# Altium schematic sheet NVME.SchDoc
size C; SheetNumber: 4; SheetTotal: 14
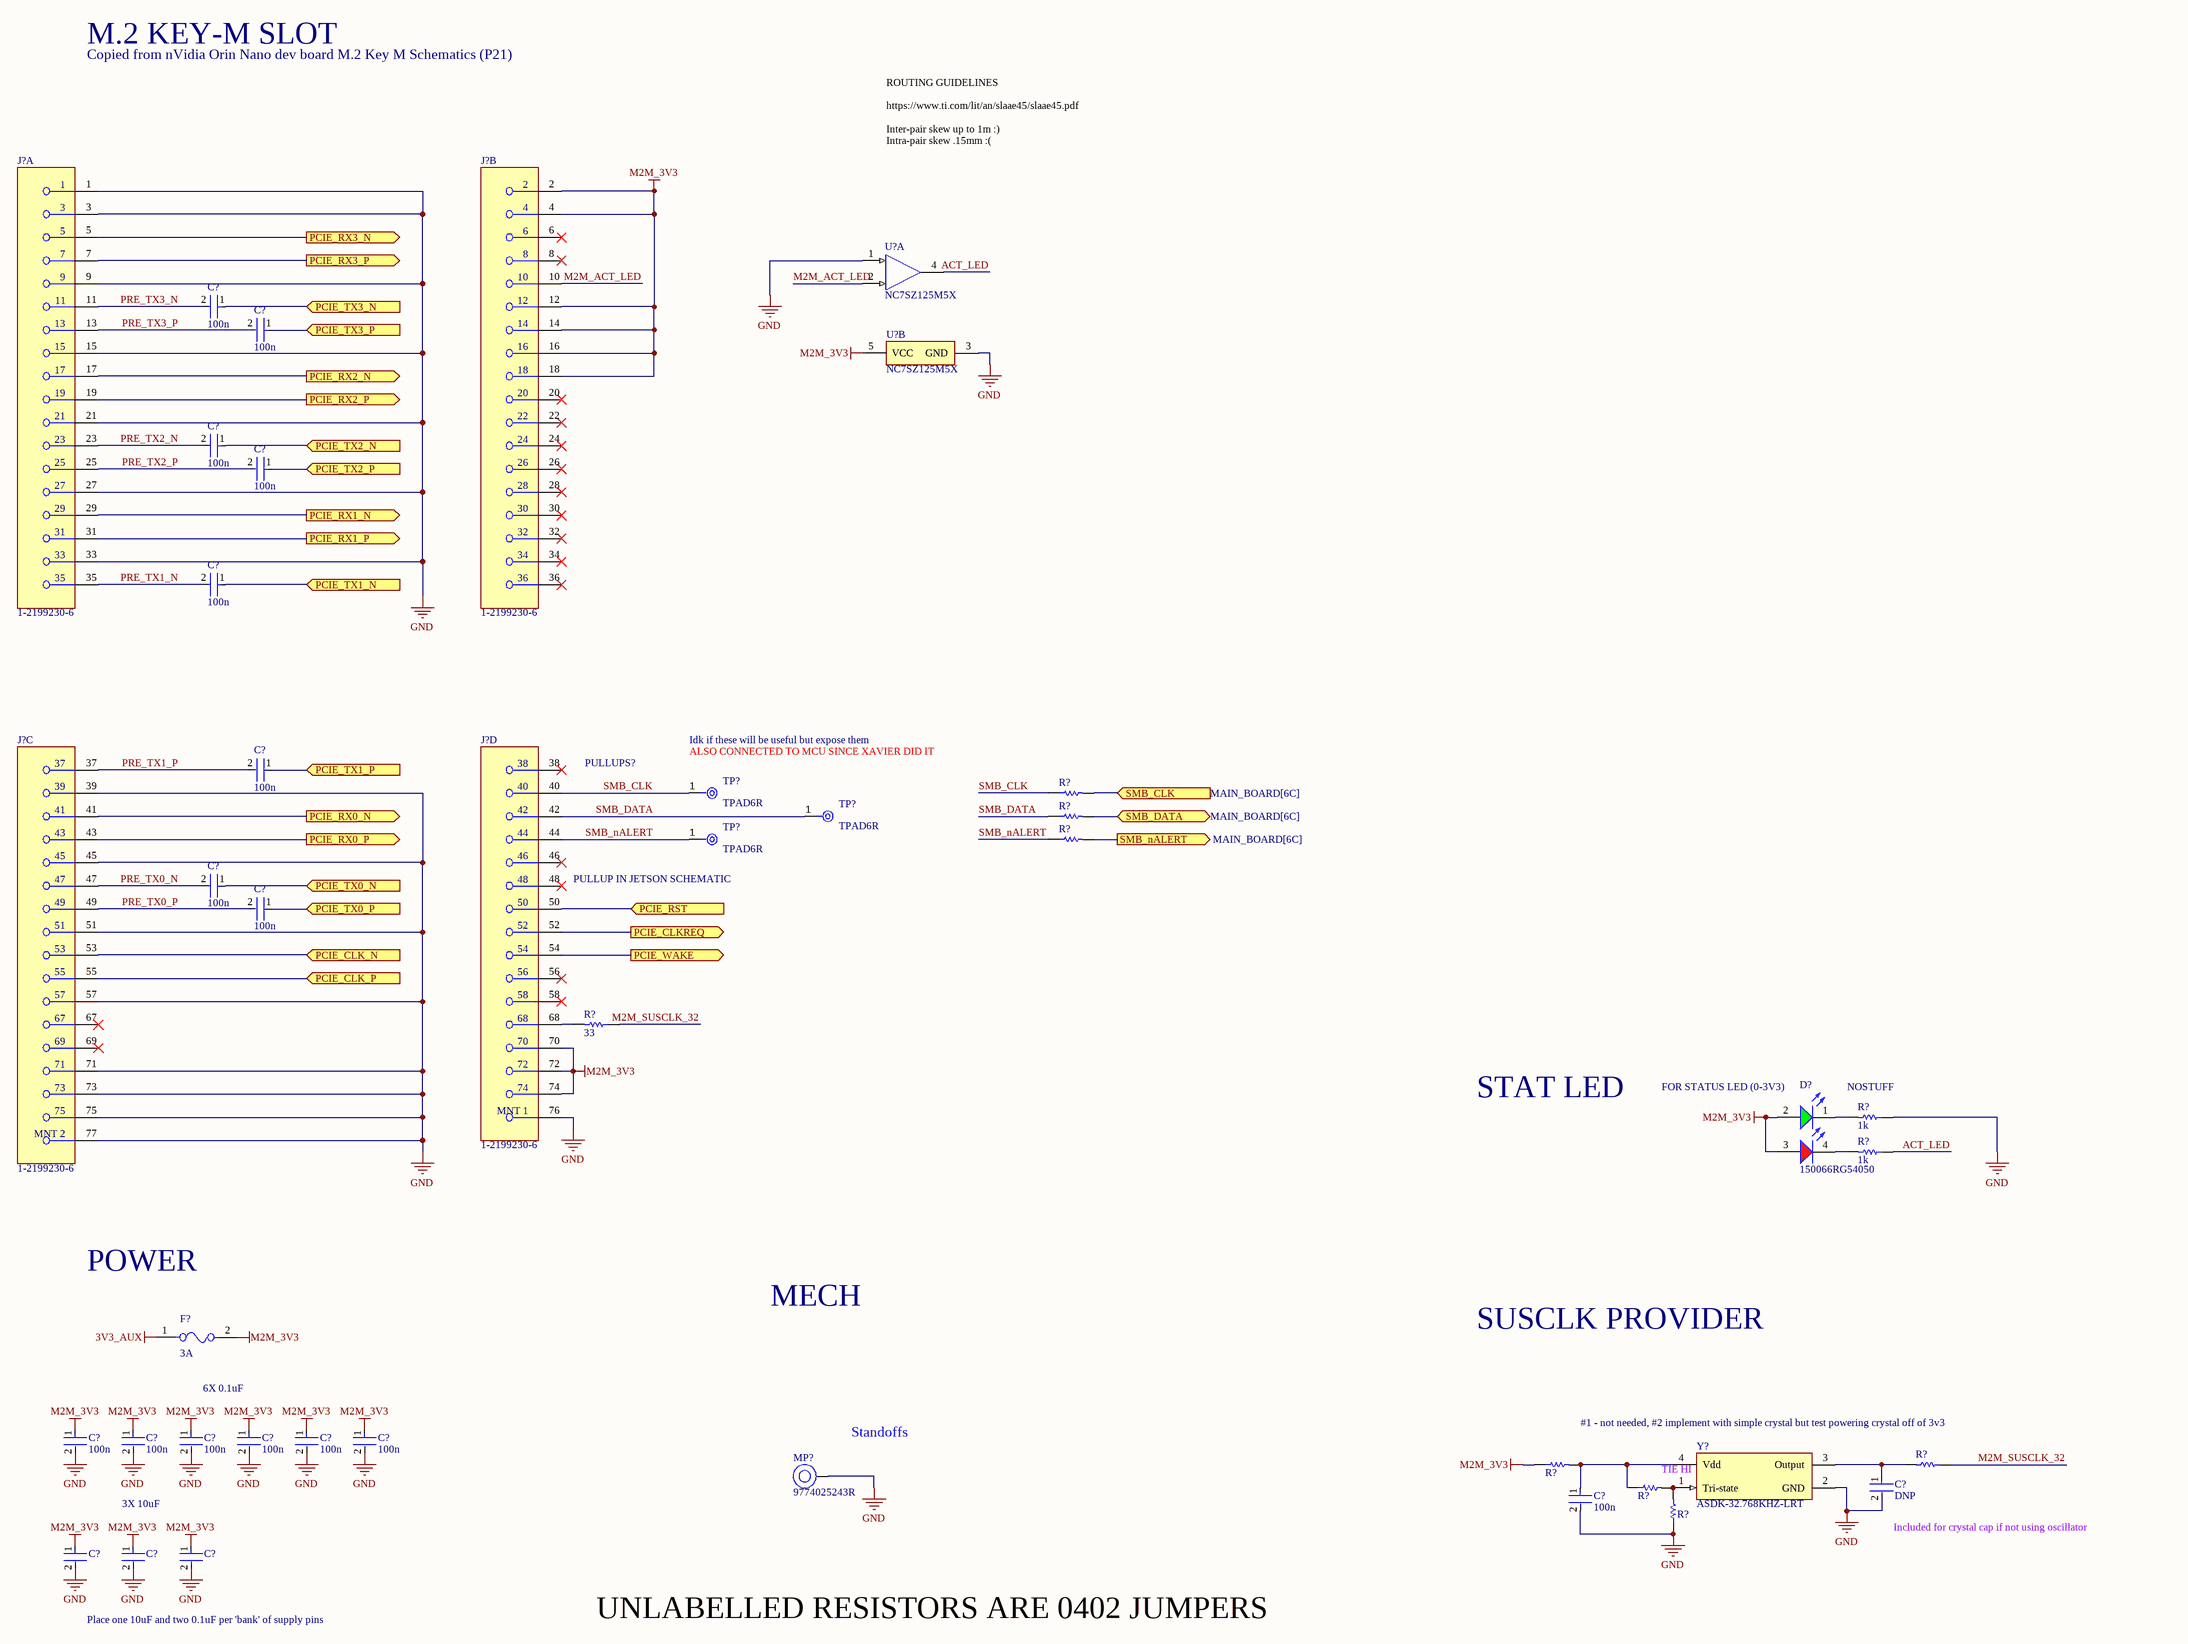
[diagram p0: NVME.SchDoc]

## Parts
(Parts that share a designator on the sheet are numbered #1, #2 ... from top to bottom, then left to right.)
C?#1  100n  [FP-0402-L_1_0_0_05-W_0_5-IPC_A]
C?#2  100n  [FP-0402-L_1_0_0_05-W_0_5-IPC_A]
C?#3  100n  [FP-0402-L_1_0_0_05-W_0_5-IPC_A]
C?#4  100n  [FP-0402-L_1_0_0_05-W_0_5-IPC_A]
C?#5  100n  [FP-0402-L_1_0_0_05-W_0_5-IPC_A]
C?#6  100n  [FP-0402-L_1_0_0_05-W_0_5-IPC_A]
C?#7  100n  [FP-0402-L_1_0_0_05-W_0_5-IPC_A]
C?#8  100n  [FP-0402-L_1_0_0_05-W_0_5-IPC_A]
C?#9  100n  [FP-0402-L_1_0_0_05-W_0_5-IPC_A]
C?#10  100n  [FP-0402-L_1_0_0_05-W_0_5-IPC_A]
C?#11  100n  [FP-0402-L_1_0_0_05-W_0_5-IPC_A]
C?#12  100n  [FP-0402-L_1_0_0_05-W_0_5-IPC_A]
C?#13  100n  [FP-0402-L_1_0_0_05-W_0_5-IPC_A]
C?#14  100n  [FP-0402-L_1_0_0_05-W_0_5-IPC_A]
C?#15  DNP  [FP-0402-L_1_0_0_05-W_0_5-IPC_A]
C?#16  100n  [FP-0402-L_1_0_0_05-W_0_5-IPC_A]
C?#17  GRM188R60J106ME47D  [FP-GRM188-0_1-e0_2_0_55-IPC_A]  (value not drawn)
C?#18  GRM188R60J106ME47D  [FP-GRM188-0_1-e0_2_0_55-IPC_A]  (value not drawn)
C?#19  GRM188R60J106ME47D  [FP-GRM188-0_1-e0_2_0_55-IPC_A]  (value not drawn)
D?  150066RG54050  [WL-SBCD_0606]
F?  3A  [FP-SF-1206FP-MFG]
J?#1  1-2199230-6  [FP-1-2199230-6-MFG]  (part A of 4)
J?#2  1-2199230-6  [FP-1-2199230-6-MFG]  (part B of 4)
J?#3  1-2199230-6  [FP-1-2199230-6-MFG]  (part C of 4)
J?#4  1-2199230-6  [FP-1-2199230-6-MFG]  (part D of 4)
MP?  9774025243R  [9774025243]
R?#1  0402 JUMPER  [RESC1005X40X25ML05T05]  (value not drawn)
R?#2  0402 JUMPER  [RESC1005X40X25ML05T05]  (value not drawn)
R?#3  0402 JUMPER  [RESC1005X40X25ML05T05]  (value not drawn)
R?#4  33  [R0603B]
R?#5  1k  [R0603B]
R?#6  1k  [R0603B]
R?#7  0402 JUMPER  [RESC1005X40X25ML05T05]  (value not drawn)
R?#8  0402 JUMPER  [RESC1005X40X25ML05T05]  (value not drawn)
R?#9  0402 JUMPER  [RESC1005X40X25ML05T05]  (value not drawn)
R?#10  DNP  [RESC1005X40X25ML05T05]  (value not drawn)
TP?#1  TPAD6R  [New footprint 1]
TP?#2  TPAD6R  [New footprint 1]
TP?#3  TPAD6R  [New footprint 1]
U?#1  NC7SZ125M5X  [FAIR-SOT23-5_V]  (part A of 2)
U?#2  NC7SZ125M5X  [FAIR-SOT23-5_V]  (part B of 2)
Y?  ASDK-32.768KHZ-LRT  [FP-ASDK-MFG]

## Ports
PCIE_CLK_N (in), PCIE_CLK_P (in), PCIE_CLKREQ (out), PCIE_RST (in), PCIE_RX0_N (out), PCIE_RX0_P (out), PCIE_RX1_N (out), PCIE_RX1_P (out), PCIE_RX2_N (out), PCIE_RX2_P (out), PCIE_RX3_N (out), PCIE_RX3_P (out), PCIE_TX0_N (in), PCIE_TX0_P (in), PCIE_TX1_N (in), PCIE_TX1_P (in), PCIE_TX2_N (in), PCIE_TX2_P (in), PCIE_TX3_N (in), PCIE_TX3_P (in), PCIE_WAKE (out), SMB_CLK (in, see MAIN_BOARD[6C]), SMB_DATA (bidir, see MAIN_BOARD[6C]), SMB_nALERT (out, see MAIN_BOARD[6C])

## Nets
3V3_AUX: F?.1
GND: C?#9.2 C?#10.2 C?#11.2 C?#12.2 C?#13.2 C?#14.2 C?#15.2 C?#16.2 C?#17.2 C?#18.2 C?#19.2 J?#1.1 J?#1.3 J?#1.9 J?#1.15 J?#1.21 J?#1.27 J?#1.33 J?#3.39 J?#3.45 J?#3.51 J?#3.57 J?#3.71 J?#3.73 J?#3.75 J?#3.77(MNT_2) J?#4.76(MNT_1) MP?.1 R?#5.1 R?#10.1 U?#1.1(~{OE}) U?#2.3(GND) Y?.2(GND)
M2M_3V3: C?#9.1 C?#10.1 C?#11.1 C?#12.1 C?#13.1 C?#14.1 C?#17.1 C?#18.1 C?#19.1 D?.2(A) D?.3(A) F?.2 J?#2.2 J?#2.4 J?#2.12 J?#2.14 J?#2.16 J?#2.18 J?#4.70 J?#4.72 J?#4.74 R?#7.1 U?#2.5(VCC)
ACT_LED: R?#6.1 U?#1.4(Y)
M2M_ACT_LED: J?#2.10 U?#1.2(A)
M2M_SUSCLK_32: R?#4.1 R?#9.1
PCIE_CLK_N: J?#3.53 ; port PCIE_CLK_N
PCIE_CLK_P: J?#3.55 ; port PCIE_CLK_P
PCIE_CLKREQ: J?#4.52 ; port PCIE_CLKREQ
PCIE_RST: J?#4.50 ; port PCIE_RST
PCIE_RX0_N: J?#3.41 ; port PCIE_RX0_N
PCIE_RX0_P: J?#3.43 ; port PCIE_RX0_P
PCIE_RX1_N: J?#1.29 ; port PCIE_RX1_N
PCIE_RX1_P: J?#1.31 ; port PCIE_RX1_P
PCIE_RX2_N: J?#1.17 ; port PCIE_RX2_N
PCIE_RX2_P: J?#1.19 ; port PCIE_RX2_P
PCIE_RX3_N: J?#1.5 ; port PCIE_RX3_N
PCIE_RX3_P: J?#1.7 ; port PCIE_RX3_P
PCIE_TX0_N: C?#7.1 ; port PCIE_TX0_N
PCIE_TX0_P: C?#8.1 ; port PCIE_TX0_P
PCIE_TX1_N: C?#5.1 ; port PCIE_TX1_N
PCIE_TX1_P: C?#6.1 ; port PCIE_TX1_P
PCIE_TX2_N: C?#3.1 ; port PCIE_TX2_N
PCIE_TX2_P: C?#4.1 ; port PCIE_TX2_P
PCIE_TX3_N: C?#1.1 ; port PCIE_TX3_N
PCIE_TX3_P: C?#2.1 ; port PCIE_TX3_P
PCIE_WAKE: J?#4.54 ; port PCIE_WAKE
PRE_TX0_N: C?#7.2 J?#3.47
PRE_TX0_P: C?#8.2 J?#3.49
PRE_TX1_N: C?#5.2 J?#1.35
PRE_TX1_P: C?#6.2 J?#3.37
PRE_TX2_N: C?#3.2 J?#1.23
PRE_TX2_P: C?#4.2 J?#1.25
PRE_TX3_N: C?#1.2 J?#1.11
PRE_TX3_P: C?#2.2 J?#1.13
SMB_CLK: J?#4.40 R?#1.1 TP?#1.1(TP)
SMB_CLK: R?#1.2 ; port SMB_CLK  [a separate net that carries the same name]
SMB_DATA: J?#4.42 R?#2.1 TP?#2.1(TP)
SMB_DATA: R?#2.2 ; port SMB_DATA  [a separate net that carries the same name]
SMB_nALERT: J?#4.44 R?#3.1 TP?#3.1(TP)
SMB_nALERT: R?#3.2 ; port SMB_nALERT  [a separate net that carries the same name]
NetC?#15_1: C?#15.1 R?#9.2 Y?.3(Output)
NetC?#16_1: C?#16.1 R?#7.2 R?#8.1 Y?.4(Vdd)
NetD?_1: D?.1(K) R?#5.2
NetD?_4: D?.4(K) R?#6.2
NetJ?#4_68: J?#4.68 R?#4.2
NetR?#8_2: R?#8.2 R?#10.2 Y?.1(Tri-state)

Not connected (* = marked no-connect by the designer): J?#2 6* 8* 20* 22* 24* 26* 28* 30* 32* 34* 36*; J?#3 67* 69*; J?#4 38* 46* 48* 56* 58*

## Notes on the sheet
- Copied from nVidia Orin Nano dev board M.2 Key M Schematics (P21)
- M.2 KEY-M SLOT
- ROUTING GUIDELINES
  https://www.ti.com/lit/an/slaae45/slaae45.pdf
  Inter-pair skew up to 1m :)
  Intra-pair skew .15mm :(
- PULLUPS?
- Idk if these will be useful but expose them
- (near TP?#1) ALSO CONNECTED TO MCU SINCE XAVIER DID IT
- PULLUP IN JETSON SCHEMATIC
- STAT LED
- (near D?) FOR STATUS LED (0-3V3)
- (near R?#5) NOSTUFF
- POWER
- MECH
- SUSCLK PROVIDER
- (near C?#12) 6X 0.1uF
- #1 - not needed, #2 implement with simple crystal but test powering crystal off of 3v3
- Standoffs
- (near Y?) TIE HI
- (near C?#18) 3X 10uF
- (near C?#15) Included for crystal cap if not using oscillator
- Place one 10uF and two 0.1uF per 'bank' of supply pins
- UNLABELLED RESISTORS ARE 0402 JUMPERS

## Library data of the parts
C?#1-C?#16 = CMP-001-00058-1: LARGE PADS, 0402 CAP, CHANGE COMMENT TO MATCH REAL P/N; Capacitor Type: Ceramic; Min Operating Temperature: -55°C; Mounting Technology: Surface Mount; Pins: 2; Case/Package: 0402; RoHS Compliant: Yes; Max Operating Temperature: 85°C
C?#17-C?#19 = CMP-2006-02792-2: Chip Multilayer Ceramic Capacitors for General Purpose, 0603, 10uF, X5R, 15%, 20%, 6.3V; Packaging: Tape and Reel; Voltage Rating (DC): 6.3V; Width: 0.031inch; Termination: SMD/SMT; Dielectric: X5R; Package Quantity: 4000; Voltage Rating: 6.3V; Capacitance: 10uF; Case/Package: 0603; Min Operating Temperature: -55°C; Voltage: 6.3V; Length: 1.6mm; Thickness: 0.035inch; Lead Free: Lead Free; Depth: 0.8mm; Case Code (Imperial): 0603; Max Operating Temperature: 85°C; Material: Ceramic; Height: 0.8mm; Tolerance: 20%; Mount: Surface Mount; REACH SVHC: No SVHC; Radiation Hardening: No; Case Code (Metric): 1608
D? = CMP-004-00040-2: Led, Red/Grn, 180Mcd/230Mcd, 624Nm/525Nm Rohs Compliant: Yes; Source: rgled.SchLib; Component Type: Standard; Pins: 4; Design Item ID: CMP-004-00034-2
F? = CMP-07399-000013-1: FUSE BOARD MOUNT 2A 63VDC 1206; Voltage Rating (DC): 63V; Fuse Type: Board Mount (Cartridge Style Excluded); Approvals: UL; Mount: Surface Mount; Min Operating Temperature: -20°C; Max Operating Temperature: 105°C; Case Code (Imperial): 1206; Packaging: Cut Tape; Current Rating: 2A; RoHS Compliant: Yes; Series: SinglFuse™ SF-1206FP; Case Code (Metric): 3216; Case/Package: 1206
J?#1-J?#4 = CMP-03365-000001-1: CONN EDGE DUAL FMALE 67POS 0.020; Manufacturer: TE; Number Of Contacts: 67; Current Rating: 0.5A; Pitch: 0.5mm; Conn Gender: Female; Is Female: yes; Voltage Rating: 50V; Conn Orientation: Right Angle; Automotive: No; Temperature Range High: +80°C; Package: 1-2199230-6; Category: Conn; Temperature: -40°C to +80°C; Number Of Rows: 2; ComponentLink2URL: http://www.te.com/commerce/DocumentDelivery/DDEController?Action=showdoc&DocId=Specification+Or+Standard%7F114-115006%7FB%7Fpdf%7FEnglish%7FENG_SS_114-115006_B_114-115006_REV_B.pdf%7F1-2199230-6; Manufacturer Part Number: 1-2199230-6; Height: 4.2mm; RoHS: TRUE; Footprint Url: http://www.te.com/commerce/DocumentDelivery/DDEController?Action=showdoc&DocId=Customer+Drawing%7F2199230%7FB2%7Fpdf%7FEnglish%7FENG_CD_2199230_B2.pdf%7F1-2199230-6; Digikey Description: CONN EDGE DUAL FMALE 67POS 0.020; Device Class L2: Card Edge Connectors; Contact Material: Gold,Tin; Device Class L1: Connectors; Device Class L3: unset; ComponentLink2Description: Datasheet; Temperature Range Low: -40°C; Octopart: https://octopart.com/1-2199230-6-te+connectivity-34969376; Lead Free: Yes
MP? = CMP-03913-59774857-1: 9774025243R Spacer Material: Steel, Tin-Plated Mounting: SMT Series: WA-SMST Thread D: M2; Outside Diameter: 4.3434mm; Threaded/Unthreaded: Threaded; Plating: Tin; REACH SVHC: Unknown; NexarPartId: 59774857; RoHS: Compliant; Material: Steel; Packaging: Tape and Reel; Max Operating Temperature: 150°C; Min Operating Temperature: -55°C; Length: 2.5mm; Height: 2.5mm
R?#1-R?#3 R?#7-R?#10 = CMP-009-00118-2: READ THE NAME; Pins: 2; Component Type: Standard; Design Item ID: CMP-009-00206-2; Source: 0402jump.SchLib
R?#4-R?#6 = CMP-009-00002-14: Resistor
TP?#1-TP?#3 = CMP-00025-2: Test Point .6mm
U?#1 U?#2 = CMP-2000-06816-1: TinyLogic UHS Buffer with Three-State Output, 1.65 to 5.5 V, -40 to 85 degC, 5-Pin SOT23, RoHS, Tape and Reel; Manufacturer: Fairchild Semiconductor; Input Signal Type: Single-Ended; Maximum Operating Supply Voltage: 5.5V; Number of Outputs per Chip: 1; Maximum Propagation Delay Time @ Maximum CL: 5.7@3.3V; Minimum Operating Supply Voltage: 1.65V; Maximum Quiescent Current: 2uA; Propagation Delay Test Condition: 50pF; Lead Finish: MatteTin; Number of Output Enables per Chip: 1Low; Maximum Low Level Output Current: 32mA; Output Type: 3-State; Package Version: 08/2015; Max Processing Temp: 260; Maximum High Level Output Current: -32mA; Tolerant I/Os: 5V; Bus Hold: No; Fabrication Technology: CMOS; Polarity: Non-Inverting; Typical Operating Supply Voltage: 1.8; Logic Function: Buffer/LineDriver; Manufacturer URL: https://www.fairchildsemi.com/; Mounting: SurfaceMount; Number of Channels per Chip: 1; Package Description: 5-Pin Small Outline Transistor, Body 2.9 x 1.6 mm, Pitch 0.95 mm; Package Reference: SOT23-5; Number of Elements per Chip: 1; Package URL: https://www.fairchildsemi.com/package-drawings/MA/MA05B.pdf; Datasheet URL: https://www.fairchildsemi.com/datasheets/NC/NC7SZ125.pdf; Datasheet Version: Rev. 1.0.5, 01/2014; Mounting Technology: SurfaceMount; Operating Temperature: -40to85C; Number of Inputs per Chip: 1
Y? = CMP-27762-001115-1: XTAL OSC XO 32.7680KHZ CMOS SMD; Load Capacitance: 15pF; Max Supply Current: 3.5mA; Min Supply Voltage: 2.97V; Operating Supply Voltage: 3.3V; Frequency Stability: 25ppm; Lead Free: Lead Free; Case/Package: CSMD; Number of Pins: 4; Max Operating Temperature: 85°C; Packaging: Tape and Reel; Width: 0.079inch; Min Operating Temperature: -40°C; Radiation Hardening: No; Length: 2.5mm; Depth: 2mm; Termination: SMD/SMT; Height: 0.037inch; Series: ASDK; Frequency: 32.768kHz; Mount: Surface Mount